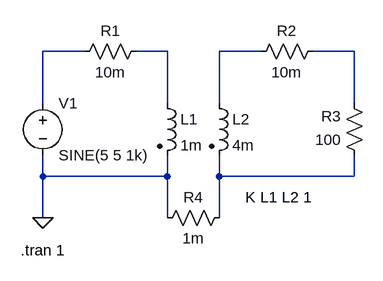
[diagram p0: schematic ElectronFlow-Theory-TestCircuit.asc]
ElectronFlow-Theory-TestCircuit.asc, the LTspice schematic file:
Version 4
SHEET 1 880 680
WIRE 48 64 -16 64
WIRE 176 64 128 64
WIRE 320 64 256 64
WIRE 464 64 400 64
WIRE -16 144 -16 64
WIRE 176 144 176 64
WIRE 256 144 256 64
WIRE 464 144 464 64
WIRE -16 256 -16 224
WIRE 176 256 176 224
WIRE 176 256 -16 256
WIRE 256 256 256 224
WIRE 464 256 464 224
WIRE 464 256 256 256
WIRE -16 320 -16 256
WIRE 176 320 176 256
WIRE 256 320 256 256
FLAG -16 320 0
SYMBOL voltage -16 128 R0
WINDOW 123 0 0 Left 0
WINDOW 39 0 0 Left 0
SYMATTR InstName V1
SYMATTR Value SINE(5 5 1k)
SYMBOL res 144 48 R90
WINDOW 0 0 56 VBottom 2
WINDOW 3 32 56 VTop 2
SYMATTR InstName R1
SYMATTR Value 10m
SYMBOL res 416 48 R90
WINDOW 0 0 56 VBottom 2
WINDOW 3 32 56 VTop 2
SYMATTR InstName R2
SYMATTR Value 10m
SYMBOL res 480 240 R180
WINDOW 0 36 76 Left 2
WINDOW 3 36 40 Left 2
SYMATTR InstName R3
SYMATTR Value 100
SYMBOL ind2 160 128 R0
SYMATTR InstName L1
SYMATTR Value 1m
SYMATTR Type ind
SYMATTR SpiceLine Rser=200m
SYMBOL ind2 240 128 R0
SYMATTR InstName L2
SYMATTR Value 4m
SYMATTR Type ind
SYMATTR SpiceLine Rser=200m
SYMBOL res 272 304 R90
WINDOW 0 0 56 VBottom 2
WINDOW 3 32 56 VTop 2
SYMATTR InstName R4
SYMATTR Value 1m
TEXT 296 288 Left 2 !K L1 L2 1
TEXT -50 370 Left 2 !.tran 1

The netlist it stands for:
* ElectronFlow-Theory-TestCircuit.asc
V1 N001 0 SINE(5 5 1k)
R1 N002 N001 10m
R2 N004 N003 10m
R3 N005 N004 100
L1 N002 0 1m Rser=200m
L2 N003 N005 4m Rser=200m
R4 N005 0 1m
K L1 L2 1
.tran 1
.backanno
.end